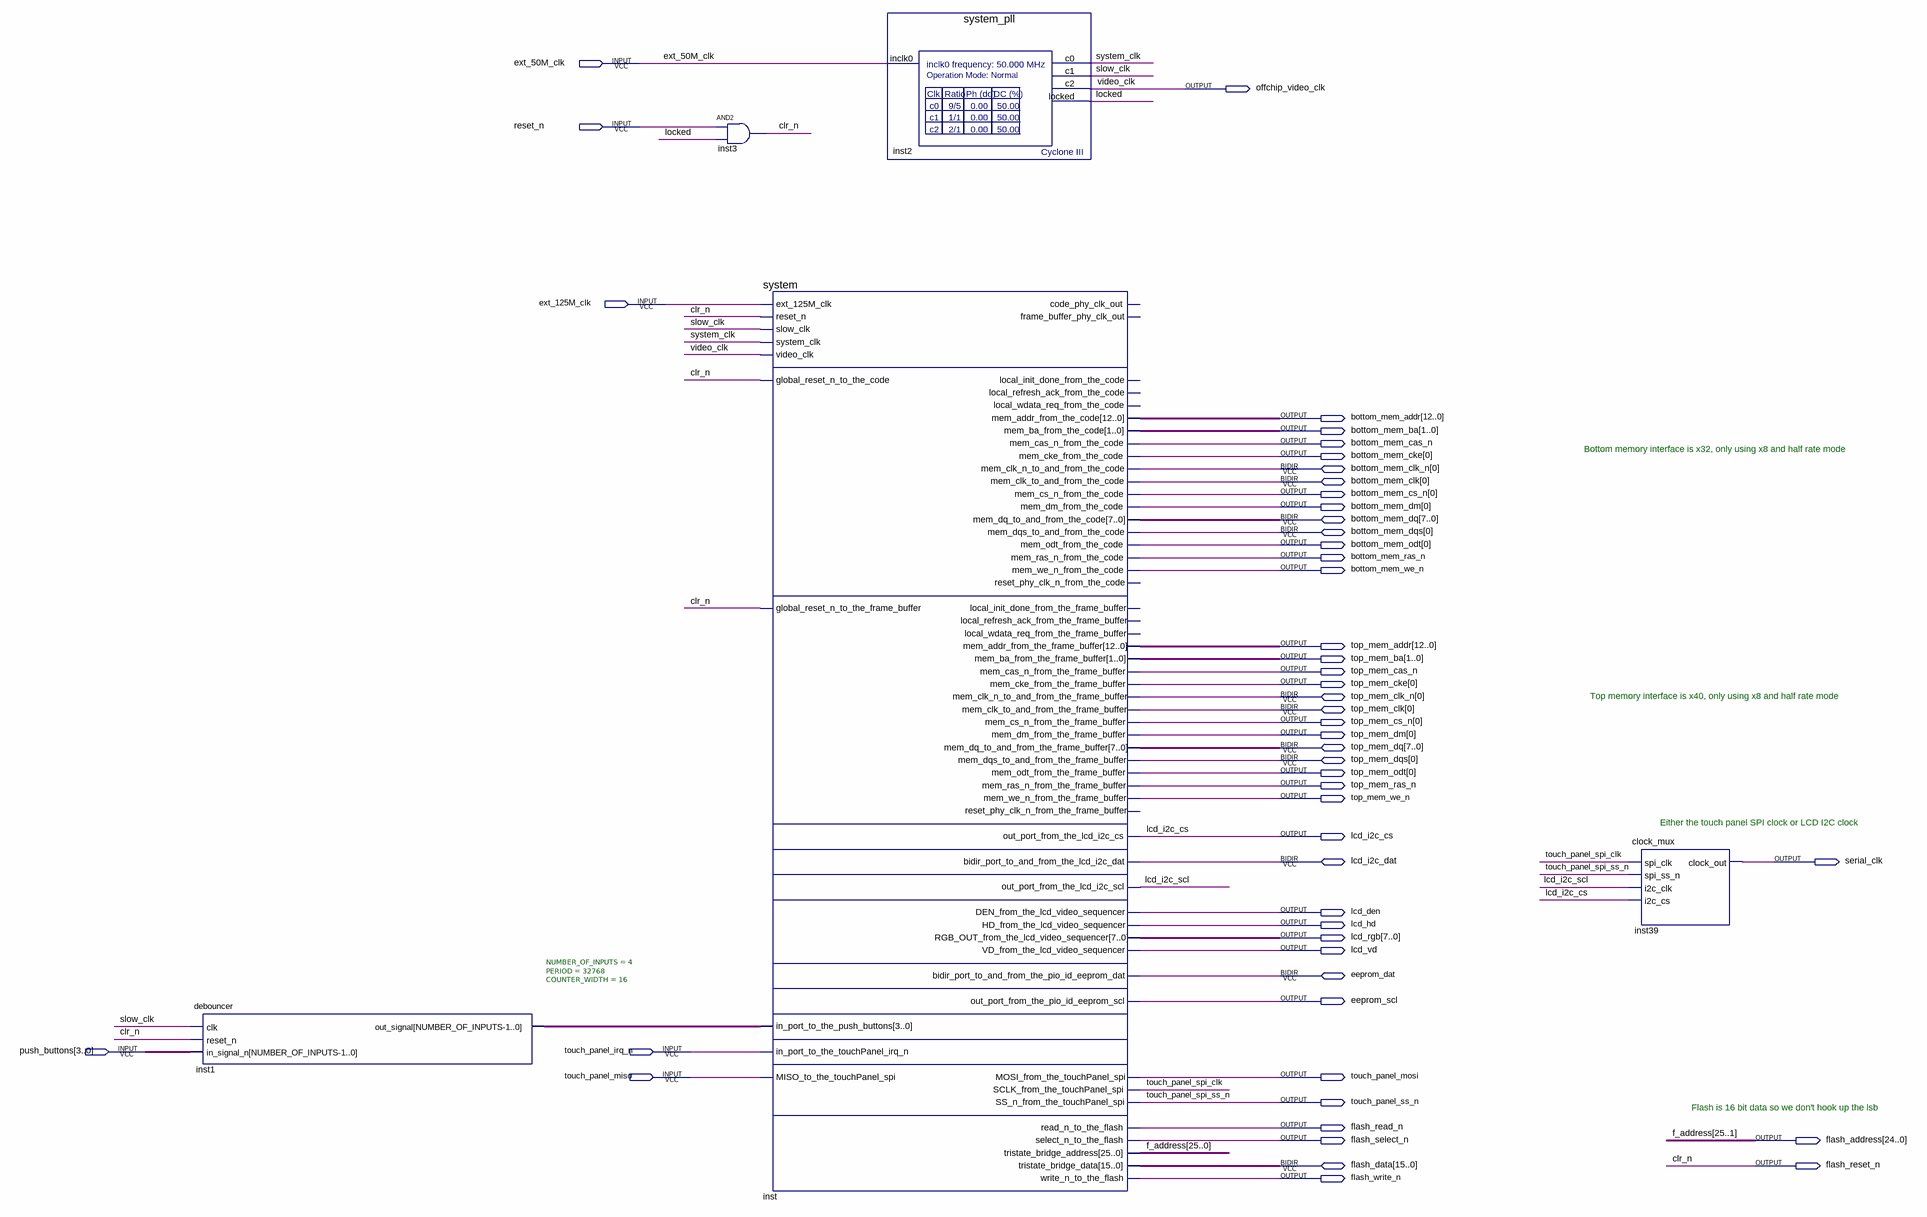
[diagram p0: schematic sheet]
// Quartus schematic C2H_Mandelbrot.bdf as structural Verilog: 5 symbols, 50 pins
module C2H_Mandelbrot (
  input  ext_50M_clk,
  input  reset_n,
  input  ext_125M_clk,
  input  [3:0] push_buttons,
  input  touch_panel_irq_n,
  input  touch_panel_miso,
  inout  [0:0] bottom_mem_clk_n,
  inout  [0:0] bottom_mem_clk,
  inout  [7:0] bottom_mem_dq,
  inout  [0:0] bottom_mem_dqs,
  inout  [0:0] top_mem_clk_n,
  inout  [0:0] top_mem_clk,
  inout  [7:0] top_mem_dq,
  inout  [0:0] top_mem_dqs,
  inout  lcd_i2c_dat,
  inout  eeprom_dat,
  inout  [15:0] flash_data,
  output offchip_video_clk,
  output [12:0] bottom_mem_addr,
  output [1:0] bottom_mem_ba,
  output bottom_mem_cas_n,
  output [0:0] bottom_mem_cke,
  output [0:0] bottom_mem_cs_n,
  output [0:0] bottom_mem_dm,
  output [0:0] bottom_mem_odt,
  output bottom_mem_ras_n,
  output bottom_mem_we_n,
  output [12:0] top_mem_addr,
  output [1:0] top_mem_ba,
  output top_mem_cas_n,
  output [0:0] top_mem_cke,
  output [0:0] top_mem_cs_n,
  output [0:0] top_mem_dm,
  output [0:0] top_mem_odt,
  output top_mem_ras_n,
  output top_mem_we_n,
  output lcd_i2c_cs,
  output serial_clk,
  output lcd_den,
  output lcd_hd,
  output [7:0] lcd_rgb,
  output lcd_vd,
  output eeprom_scl,
  output touch_panel_mosi,
  output touch_panel_ss_n,
  output flash_read_n,
  output flash_select_n,
  output [24:0] flash_address,
  output flash_reset_n,
  output flash_write_n
);

  wire lcd_i2c_scl, locked, slow_clk, system_clk, touch_panel_spi_clk;
  wire [0:0] f_address;
  wire [3:0] inst1_out_signal;

  debouncer #(.NUMBER_OF_INPUTS(4), .PERIOD(32768), .COUNTER_WIDTH(16)) inst1 (
    .clk(slow_clk), .reset_n(flash_reset_n), .in_signal_n(push_buttons), .out_signal(inst1_out_signal));
  and inst3 (flash_reset_n, reset_n, locked);
  system inst (
    .ext_125M_clk(ext_125M_clk), .reset_n(flash_reset_n), .slow_clk(slow_clk), .system_clk(system_clk),
    .video_clk(offchip_video_clk), .global_reset_n_to_the_code(flash_reset_n),
    .global_reset_n_to_the_frame_buffer(flash_reset_n), .in_port_to_the_push_buttons(inst1_out_signal),
    .in_port_to_the_touchPanel_irq_n(touch_panel_irq_n), .MISO_to_the_touchPanel_spi(touch_panel_miso),
    .mem_addr_from_the_code(bottom_mem_addr), .mem_ba_from_the_code(bottom_mem_ba),
    .mem_cas_n_from_the_code(bottom_mem_cas_n), .mem_cke_from_the_code(bottom_mem_cke[0]),
    .mem_cs_n_from_the_code(bottom_mem_cs_n[0]), .mem_dm_from_the_code(bottom_mem_dm[0]),
    .mem_odt_from_the_code(bottom_mem_odt[0]), .mem_ras_n_from_the_code(bottom_mem_ras_n),
    .mem_we_n_from_the_code(bottom_mem_we_n), .mem_addr_from_the_frame_buffer(top_mem_addr),
    .mem_ba_from_the_frame_buffer(top_mem_ba), .mem_cas_n_from_the_frame_buffer(top_mem_cas_n),
    .mem_cke_from_the_frame_buffer(top_mem_cke[0]), .mem_cs_n_from_the_frame_buffer(top_mem_cs_n[0]),
    .mem_dm_from_the_frame_buffer(top_mem_dm[0]), .mem_odt_from_the_frame_buffer(top_mem_odt[0]),
    .mem_ras_n_from_the_frame_buffer(top_mem_ras_n), .mem_we_n_from_the_frame_buffer(top_mem_we_n),
    .out_port_from_the_lcd_i2c_cs(lcd_i2c_cs), .out_port_from_the_lcd_i2c_scl(lcd_i2c_scl),
    .DEN_from_the_lcd_video_sequencer(lcd_den), .HD_from_the_lcd_video_sequencer(lcd_hd),
    .RGB_OUT_from_the_lcd_video_sequencer(lcd_rgb), .VD_from_the_lcd_video_sequencer(lcd_vd),
    .out_port_from_the_pio_id_eeprom_scl(eeprom_scl), .MOSI_from_the_touchPanel_spi(touch_panel_mosi),
    .SCLK_from_the_touchPanel_spi(touch_panel_spi_clk), .SS_n_from_the_touchPanel_spi(touch_panel_ss_n),
    .read_n_to_the_flash(flash_read_n), .select_n_to_the_flash(flash_select_n),
    .tristate_bridge_address({flash_address, f_address[0]}), .write_n_to_the_flash(flash_write_n),
    .mem_clk_n_to_and_from_the_code(bottom_mem_clk_n[0]), .mem_clk_to_and_from_the_code(bottom_mem_clk[0]),
    .mem_dq_to_and_from_the_code(bottom_mem_dq), .mem_dqs_to_and_from_the_code(bottom_mem_dqs[0]),
    .mem_clk_n_to_and_from_the_frame_buffer(top_mem_clk_n[0]),
    .mem_clk_to_and_from_the_frame_buffer(top_mem_clk[0]), .mem_dq_to_and_from_the_frame_buffer(top_mem_dq),
    .mem_dqs_to_and_from_the_frame_buffer(top_mem_dqs[0]),
    .bidir_port_to_and_from_the_lcd_i2c_dat(lcd_i2c_dat),
    .bidir_port_to_and_from_the_pio_id_eeprom_dat(eeprom_dat), .tristate_bridge_data(flash_data));  // open: code_phy_clk_out, frame_buffer_phy_clk_out, local_init_done_from_the_code, local_refresh_ack_from_the_code, local_wdata_req_from_the_code, reset_phy_clk_n_from_the_code, local_init_done_from_the_frame_buffer, local_refresh_ack_from_the_frame_buffer, local_wdata_req_from_the_frame_buffer, reset_phy_clk_n_from_the_frame_buffer
  system_pll inst2 (.inclk0(ext_50M_clk), .c0(system_clk), .c1(slow_clk), .c2(offchip_video_clk), .locked(locked));
  clock_mux inst39 (
    .spi_clk(touch_panel_spi_clk), .spi_ss_n(touch_panel_ss_n), .i2c_clk(lcd_i2c_scl), .i2c_cs(lcd_i2c_cs),
    .clock_out(serial_clk));

  // Other names for the same wires on the sheet: clr_n = flash_reset_n; f_address[25:1] = flash_address;
  //   touch_panel_spi_ss_n = touch_panel_ss_n; video_clk = offchip_video_clk

  // Notes on the sheet:
  //   Bottom memory interface is x32, only using x8 and half rate mode
  //   Top memory interface is x40, only using x8 and half rate mode
  //   Either the touch panel SPI clock or LCD I2C clock
  //   Flash is 16 bit data so we don't hook up the lsb
endmodule
